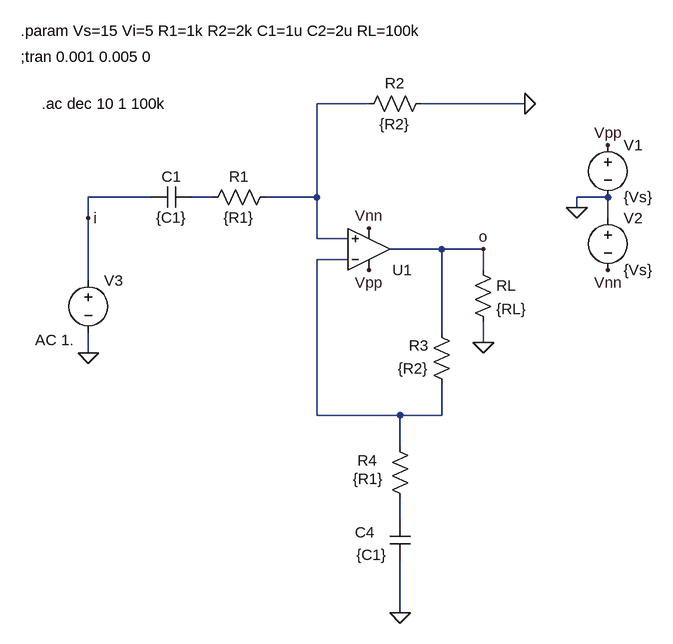
[diagram p0: schematic Filter05.asc]
Filter05.asc, the LTspice schematic file:
Version 4
SHEET 1 968 804
WIRE 144 0 64 0
WIRE 384 0 224 0
WIRE -192 144 -288 144
WIRE -96 144 -128 144
WIRE 64 144 64 0
WIRE 64 144 -16 144
WIRE 512 144 464 144
WIRE 464 160 464 144
WIRE -288 176 -288 144
WIRE 512 176 512 144
WIRE 64 208 64 144
WIRE 112 208 64 208
WIRE 256 224 176 224
WIRE 320 224 256 224
WIRE 112 240 64 240
WIRE 320 256 320 224
WIRE -288 272 -288 176
WIRE 256 352 256 224
WIRE 320 368 320 336
WIRE -288 384 -288 352
WIRE 64 480 64 240
WIRE 192 480 64 480
WIRE 256 480 256 432
WIRE 256 480 192 480
WIRE 192 528 192 480
WIRE 192 640 192 608
WIRE 192 784 192 704
FLAG 512 64 Vpp
FLAG 464 160 0
FLAG 512 256 Vnn
FLAG 320 368 0
FLAG -288 384 0
FLAG 144 256 Vpp
FLAG 144 192 Vnn
FLAG 320 224 o
FLAG -288 176 i
FLAG 384 0 0
FLAG 192 784 0
SYMBOL voltage 512 48 R0
WINDOW 123 0 0 Left 0
WINDOW 39 0 0 Left 0
SYMATTR InstName V1
SYMATTR Value {Vs}
SYMBOL voltage 512 160 R0
WINDOW 123 0 0 Left 0
WINDOW 39 0 0 Left 0
SYMATTR InstName V2
SYMATTR Value {Vs}
SYMBOL res 304 240 R0
SYMATTR InstName RL
SYMATTR Value {RL}
SYMBOL voltage -288 256 R0
WINDOW 3 -82 108 Left 2
WINDOW 123 0 0 Left 0
WINDOW 39 0 0 Left 0
SYMATTR Value AC 1.
SYMATTR InstName V3
SYMBOL Opamps\\UniversalOpamp2 144 224 M180
WINDOW 0 36 -32 Left 2
SYMATTR InstName U1
SYMBOL res 0 128 R90
WINDOW 0 0 56 VBottom 2
WINDOW 3 32 56 VTop 2
SYMATTR InstName R1
SYMATTR Value {R1}
SYMBOL res 240 -16 R90
WINDOW 0 0 56 VBottom 2
WINDOW 3 32 56 VTop 2
SYMATTR InstName R2
SYMATTR Value {R2}
SYMBOL res 272 448 R180
WINDOW 0 36 76 Left 2
WINDOW 3 36 40 Left 2
SYMATTR InstName R3
SYMATTR Value {R2}
SYMBOL res 208 624 R180
WINDOW 0 51 75 Left 2
WINDOW 3 41 46 Left 2
SYMATTR InstName R4
SYMATTR Value {R1}
SYMBOL cap -128 128 R90
WINDOW 0 0 32 VBottom 2
WINDOW 3 32 32 VTop 2
SYMATTR InstName C1
SYMATTR Value {C1}
SYMBOL cap 208 704 R180
WINDOW 0 55 44 Left 2
WINDOW 3 36 9 Left 2
SYMATTR InstName C4
SYMATTR Value {C1}
TEXT -392 -112 Left 2 !.param Vs=15 Vi=5 R1=1k R2=2k C1=1u C2=2u RL=100k
TEXT -392 -72 Left 2 !;tran 0.001 0.005 0
TEXT -360 0 Left 2 !.ac dec 10 1 100k

The netlist it stands for:
* Filter05.asc
V1 Vpp 0 {Vs}
V2 0 Vnn {Vs}
RL o 0 {RL}
V3 i 0 AC 1.
XU1 N001 N003 Vpp Vnn o level.2 Avol=1Meg GBW=10Meg Slew=10Meg ilimit=25m rail=0 Vos=0 phimargin=45 en=0 enk=0 in=0 ink=0 Rin=500Meg  ; pins IN+ IN- V+ V- OUT
R1 N001 N002 {R1}
R2 0 N001 {R2}
R3 N003 o {R2}
R4 N004 N003 {R1}
C1 N002 i {C1}
C4 0 N004 {C1}
.param Vs=15 Vi=5 R1=1k R2=2k C1=1u C2=2u RL=100k
;tran 0.001 0.005 0
.ac dec 10 1 100k
.lib UniversalOpamps2.sub
.backanno
.end